# EAGLE design NT1066_Discovery (EAGLE 9.6.2)
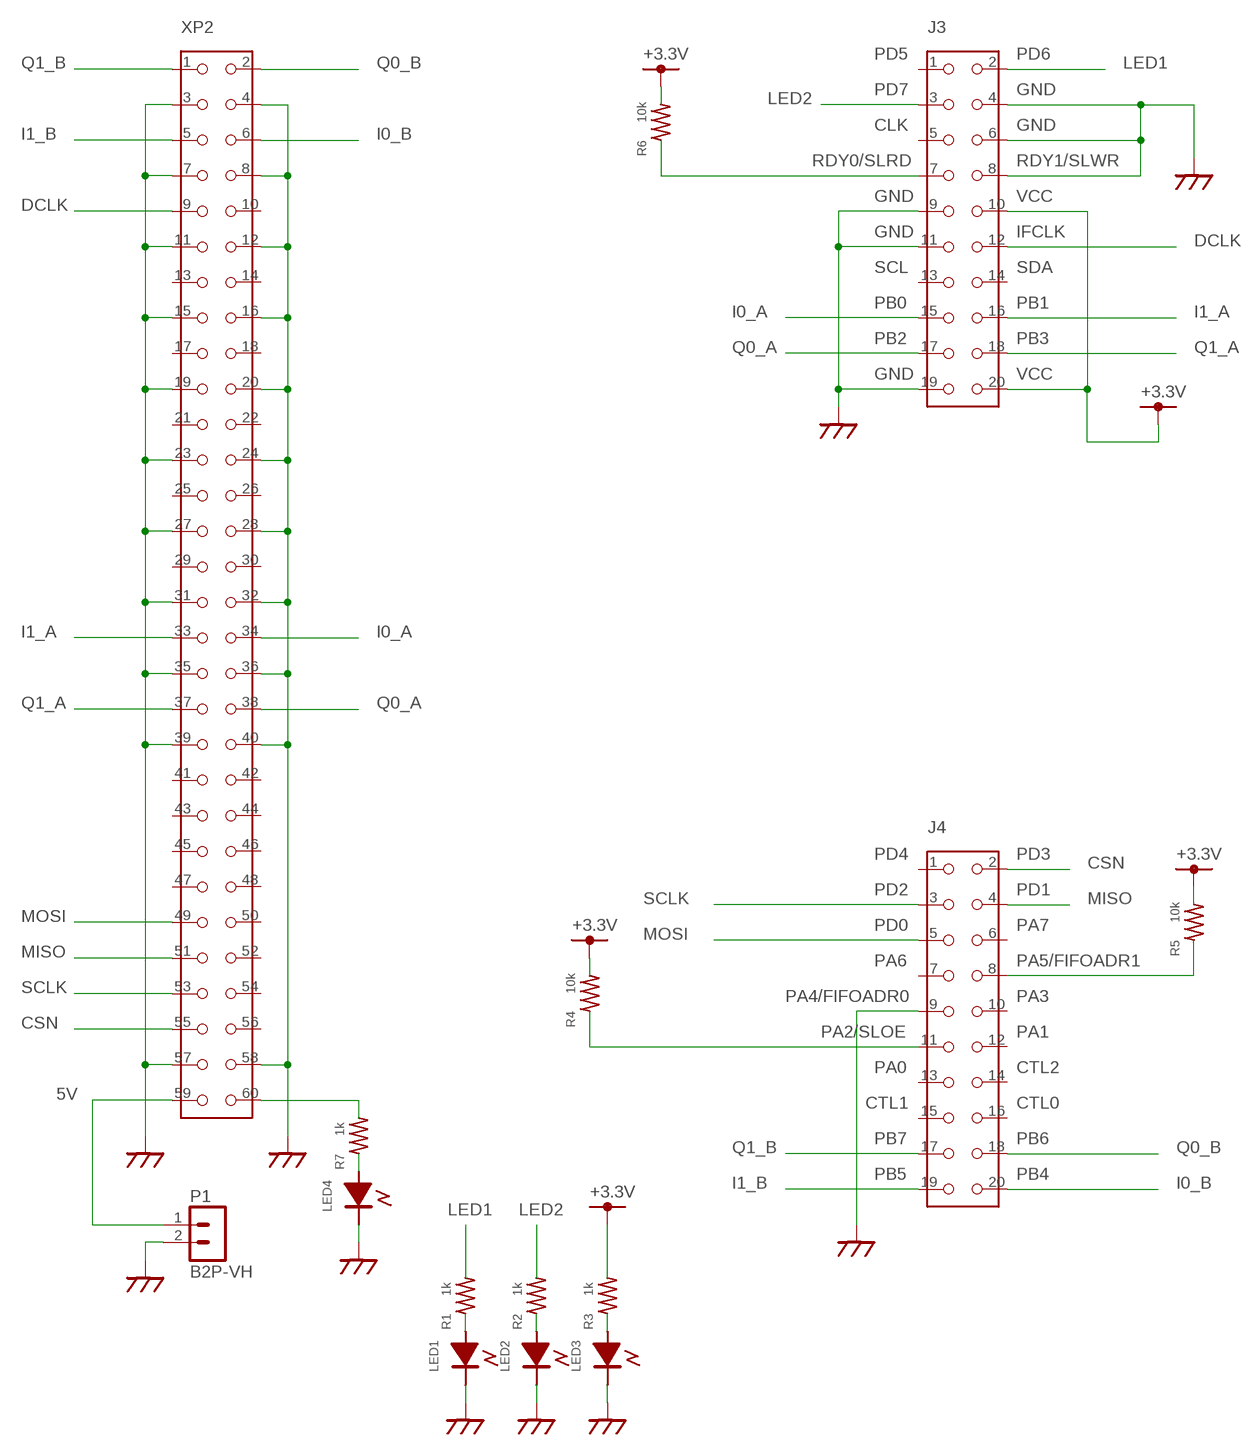
[diagram p0: schematic, sheet 1]

## Parts
J3  PINH-2.54MM-20P  [PINH-2.54MM-20P]
J4  PINH-2.54MM-20P  [PINH-2.54MM-20P]
LED1  LED1608  [LED_1608]
LED2  LED1608  [LED_1608]
LED3  LED1608  [LED_1608]
LED4  LED1608  [LED_1608]
P1  B2P-VH  [B2P-VH]
R1  1k  R1608  [C1608]
R2  1k  R1608  [C1608]
R3  1k  R1608  [C1608]
R4  10k  R1608  [C1608]
R5  10k  R1608  [C1608]
R6  10k  R1608  [C1608]
R7  1k  R1608  [C1608]
XP2  PINH-2.54MM-60P  [PINH-2.54MM-60P]

## Nets
5V: P1.1 XP2.59
+3.3V: J3.10 J3.20 R3.2 R4.2 R5.2 R6.2
CSN: J4.2 XP2.55
DCLK: J3.12 XP2.9
FIFOADR1: J4.8 R5.1
GND: J3.4 J3.6 J3.8 J3.9 J3.11 J3.19 J4.9 LED1.2 LED2.2 LED3.2 LED4.2 P1.2 XP2.3 XP2.4 XP2.7 XP2.8 XP2.11 XP2.12 XP2.15 XP2.16 XP2.19 XP2.20 XP2.23 XP2.24 XP2.27 XP2.28 XP2.31 XP2.32 XP2.35 XP2.36 XP2.39 XP2.40 XP2.57 XP2.58
I0_A: J3.15 XP2.34
I0_B: J4.20 XP2.6
I1_A: J3.16 XP2.33
I1_B: J4.19 XP2.5
LED1: J3.2 R1.2
LED2: J3.3 R2.2
MISO: J4.4 XP2.51
MOSI: J4.5 XP2.49
N$1: R7.2 XP2.60
N$2: LED4.1(+) R7.1
N$5: LED3.1(+) R3.1
N$6: LED2.1(+) R2.1
N$7: LED1.1(+) R1.1
Q0_A: J3.17 XP2.38
Q0_B: J4.18 XP2.2
Q1_A: J3.18 XP2.37
Q1_B: J4.17 XP2.1
SCLK: J4.3 XP2.53
SLOE: J4.11 R4.1
SLRD: J3.7 R6.1
Unconnected: J3.1 J3.5 J3.13 J3.14 J4.1 J4.6 J4.7 J4.10 J4.12 J4.13 J4.14 J4.15 J4.16 XP2.10 XP2.13 XP2.14 XP2.17 XP2.18 XP2.21 XP2.22 XP2.25 XP2.26 XP2.29 XP2.30 XP2.41 XP2.42 XP2.43 XP2.44 XP2.45 XP2.46 XP2.47 XP2.48 XP2.50 XP2.52 XP2.54 XP2.56

## Notes on the sheet
- PD5 | PD6
- PD7 | GND
- CLK | GND
- RDY0/SLRD | RDY1/SLWR
- GND | VCC
- GND | IFCLK
- SCL | SDA
- PB0 | PB1
- PB2 | PB3
- GND | VCC
- PD4 | PD3
- PD2 | PD1
- PD0 | PA7
- PA6 | PA5/FIFOADR1
- PA4/FIFOADR0 | PA3
- PA2/SLOE | PA1
- PA0 | CTL2
- CTL1 | CTL0
- PB7 | PB6
- PB5 | PB4

## Library data of the parts
J3 J4 = ttaka_conn:PINH-2.54MM-20P
LED1-LED4 = ttaka_desc:LED1608
P1 = ttaka_conn:B2P-VH
R1-R7 = ttaka_desc:R1608
XP2 = ttaka_conn:PINH-2.54MM-60P

## Board
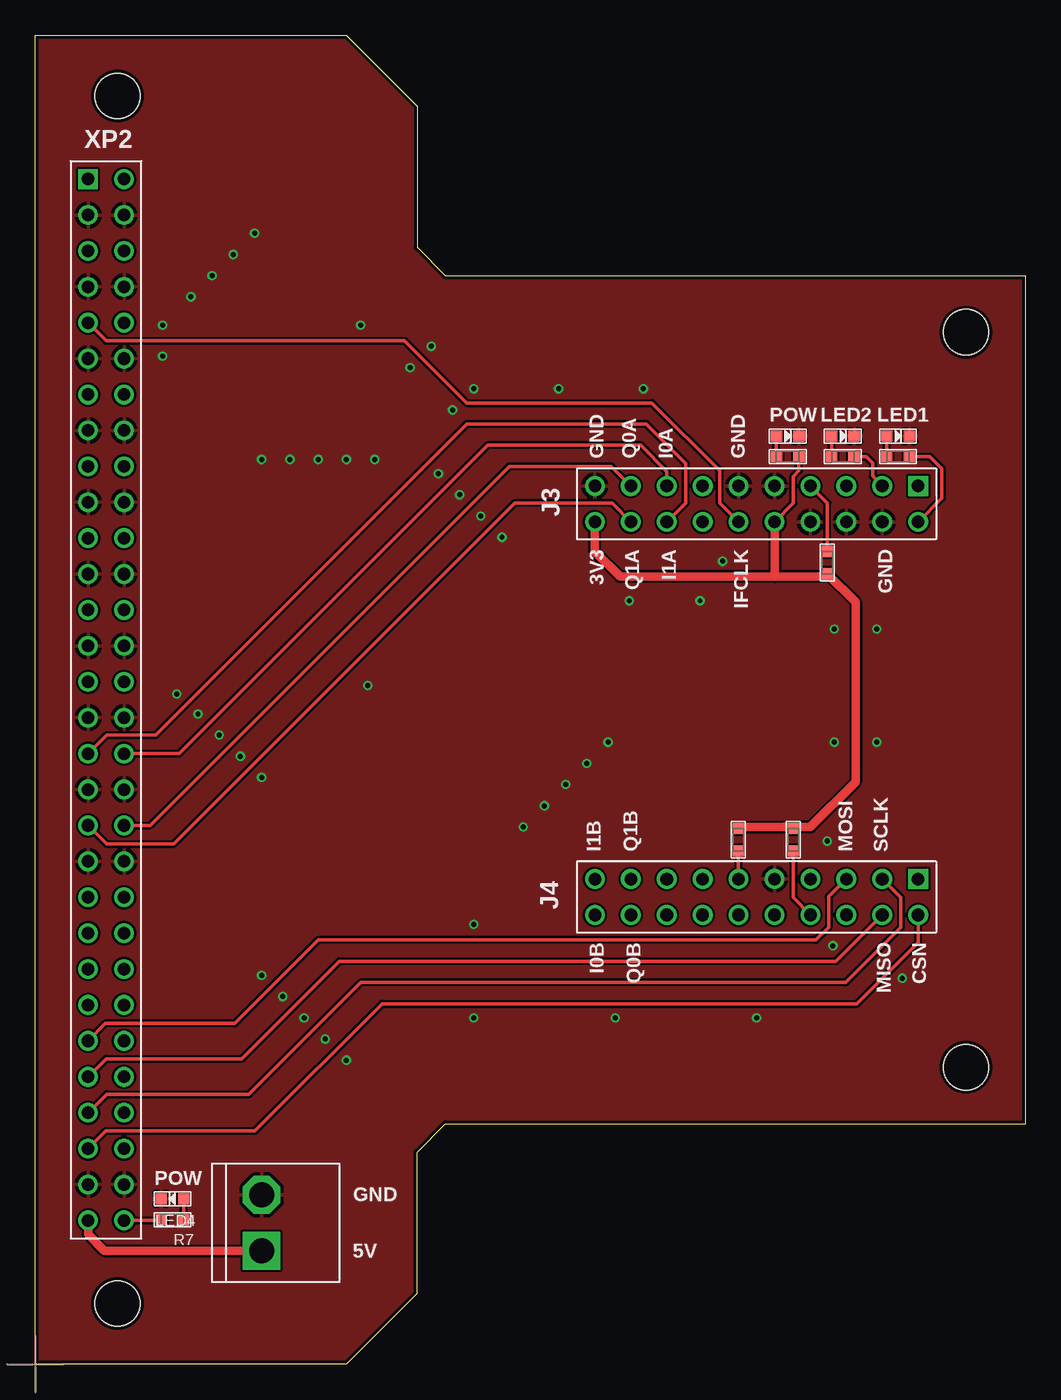
[diagram p1: board, top side]
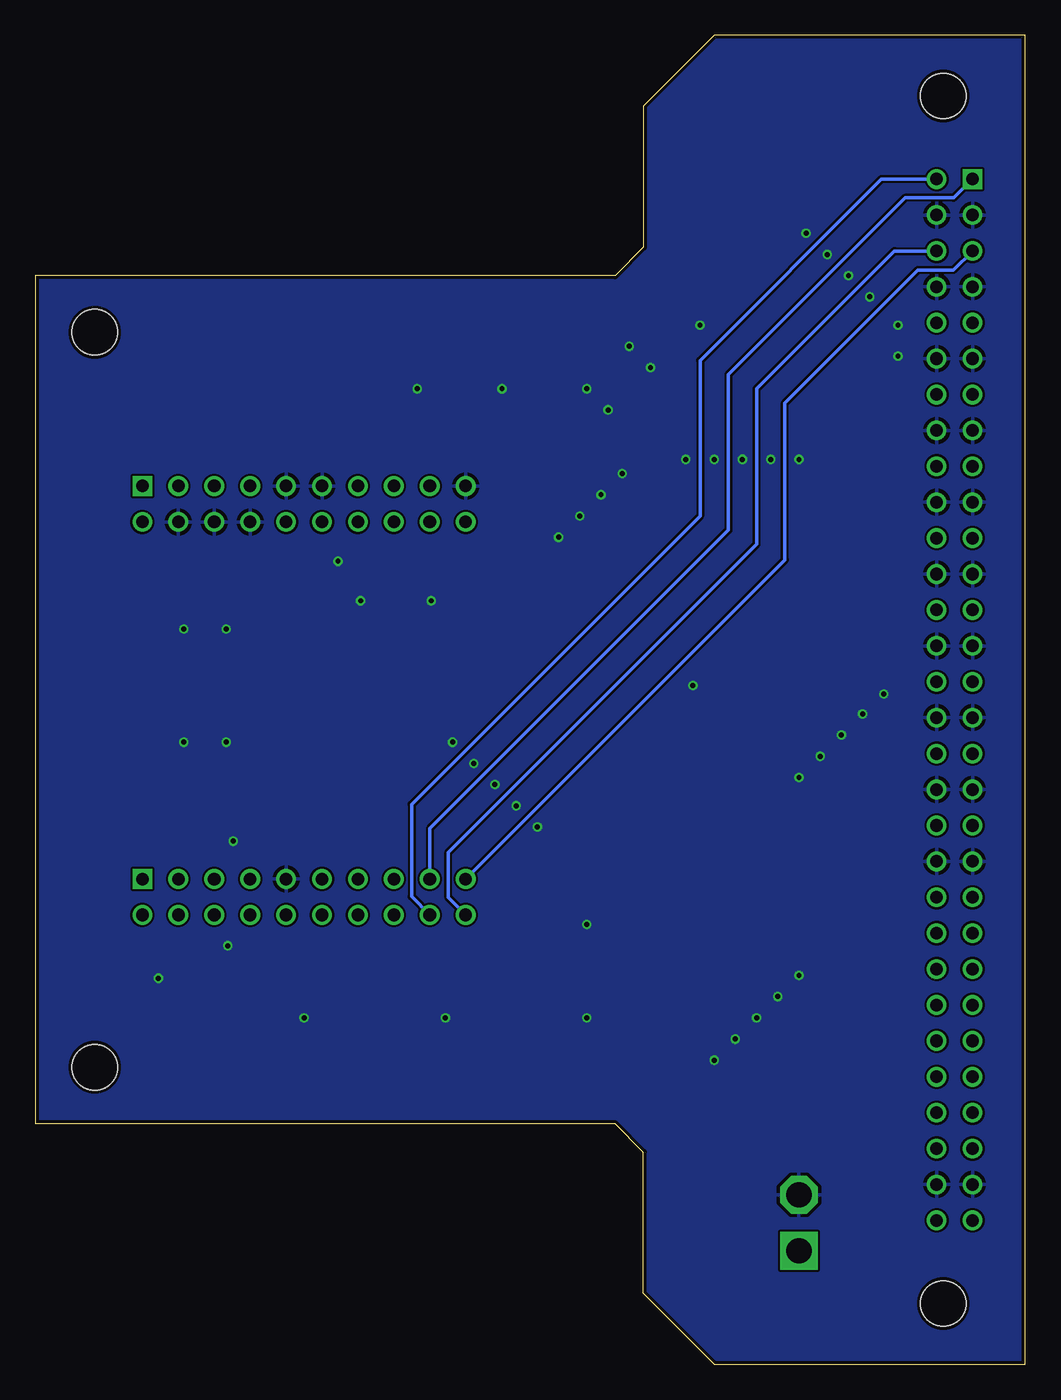
[diagram p2: board, bottom side, seen from below]

Size 70 x 94 mm. Coordinates in mm from the lower left corner, seen from the top.
Outline: 0,0 0,94 22,94 27,89 27,79 29,77 70,77 70,17 29,17 27,15 27,5 22,0 0,0
Copper layers (1*16): Top 0.035mm / dielectric 1.5mm / Bottom 0.035mm
Design rules "SeeedStudio_2layer_DRU_no_angle_20140221": minimum track width 6mil, minimum drill 12mil, track to track 6mil, track to pad 6mil, pad to pad 6mil, via to via 6mil, smd to smd 0mil, copper to edge 10mil, drill to drill 10mil, minimum pad ring 10mil, minimum via ring 6mil, stop-mask expansion 2mil, vias tented up to drill 100mil, thermal gap 10mil
Holes 3.2 mm at 5.8,89.7 5.8,4.3 65.8,21 65.8,73

### Footprints (pad centres in the part's own frame; a part is rotated, then mirrored left to right if it is on the bottom)
PINH-2.54MM-20P = drill 0.889 square: 1 -11.43,-1.27 | drill 0.889: 2 -11.43,1.27; 3 -8.89,-1.27; 4 -8.89,1.27; 5 -6.35,-1.27; 6 -6.35,1.27; 7 -3.81,-1.27; 8 -3.81,1.27; 9 -1.27,-1.27; 10 -1.27,1.27; 11 1.27,-1.27; 12 1.27,1.27; 13 3.81,-1.27; 14 3.81,1.27; 15 6.35,-1.27; 16 6.35,1.27; 17 8.89,-1.27; 18 8.89,1.27; 19 11.43,-1.27; 20 11.43,1.27
LED_1608 = smd 0.8 x 0.8: 1 -0.8,0; 2 0.8,0
B2P-VH = drill 1.778 square: 1 -1.98,0 | drill 1.778 octagon: 2 1.98,0
C1608 = smd 0.8 x 0.8: 1 -0.8,0; 2 0.8,0
PINH-2.54MM-60P = drill 0.889 square: 1 -36.83,-1.27 | drill 0.889: 2 -36.83,1.27; 3 -34.29,-1.27; 4 -34.29,1.27; 5 -31.75,-1.27; 6 -31.75,1.27; 7 -29.21,-1.27; 8 -29.21,1.27; 9 -26.67,-1.27; 10 -26.67,1.27; 11 -24.13,-1.27; 12 -24.13,1.27; 13 -21.59,-1.27; 14 -21.59,1.27; 15 -19.05,-1.27; 16 -19.05,1.27; 17 -16.51,-1.27; 18 -16.51,1.27; 19 -13.97,-1.27; 20 -13.97,1.27; 21 -11.43,-1.27; 22 -11.43,1.27; 23 -8.89,-1.27; 24 -8.89,1.27; 25 -6.35,-1.27; 26 -6.35,1.27; 27 -3.81,-1.27; 28 -3.81,1.27; 29 -1.27,-1.27; 30 -1.27,1.27; 31 1.27,-1.27; 32 1.27,1.27; 33 3.81,-1.27; 34 3.81,1.27; 35 6.35,-1.27; 36 6.35,1.27; 37 8.89,-1.27; 38 8.89,1.27; 39 11.43,-1.27; 40 11.43,1.27; 41 13.97,-1.27; 42 13.97,1.27; 43 16.51,-1.27; 44 16.51,1.27; 45 19.05,-1.27; 46 19.05,1.27; 47 21.59,-1.27; 48 21.59,1.27; 49 24.13,-1.27; 50 24.13,1.27; 51 26.67,-1.27; 52 26.67,1.27; 53 29.21,-1.27; 54 29.21,1.27; 55 31.75,-1.27; 56 31.75,1.27; 57 34.29,-1.27; 58 34.29,1.27; 59 36.83,-1.27; 60 36.83,1.27

### Placement (x,y rotation side)
J3  51,60.85 180 top
J4  51,33.05 180 top
LED1  61,65.65 0 top
LED2  57.1,65.65 0 top
LED3  53.2,65.65 0 top
LED4  9.7,11.7 180 top
P1  16,10 90 top
R1  61,64.2 0 top
R2  57.1,64.2 0 top
R3  53.2,64.2 0 top
R4  49.7,37.1 90 top
R5  53.6,37.1 90 top
R6  56,56.7 270 top
R7  9.7,10.2 180 top
XP2  5,47 270 top

### Tracks (layer width: path | path; a pad name or v marks a point on that pad's centre or on a via)
5V
  Top 0.61: XP2.59 3.73,9.17 4.88,8.02 P1.1
+3.3V
  Top 0.254: J3.10 53.6,60.91 53.6,62.8 54,63.2 R3.2 | R4.2 49.8,38 | R5.2 53.5,38
  Top 0.406: 52.27,55.73 52.3,55.7
  Top 0.61: J3.10 52.27,55.73 | 49.8,38 53.5,38 54.8,38 58,41.2 58,53.9 R6.2 56.2,55.7 52.3,55.7 41.35,55.7 39.57,57.48 J3.20 39.57,59.63
CSN
  Top 0.254: J4.2 62.43,29.83 58.1,25.5 24.52,25.5 15.52,16.5 4.98,16.5 XP2.55
DCLK
  Top 0.254: XP2.9 5,72.4 26.1,72.4 30.5,68 43.6,68 48.4,63.2 48.4,60.91 J3.12
FIFOADR1
  Top 0.254: R5.1 53.6,33 J4.8
GND  (via drill 0.35)
  other vias: 18,64 16,64 11.5,46 13,44.5 14.5,43 16,41.5 10,47.4 33,58.5 40.5,44 22,64 24,64 20,64 36,39.5 34.5,38 19,24.5 20.5,23 22,21.5 17.5,26 16,27.5 61.3,27.3 56.4,29.6 51,24.5 41,24.5 31,24.5 31,31.1 56,37 39,42.5 37.5,41 56.5,44 59.5,44 56.5,52 59.5,52 23.5,48 48.6,56.8 47,54 42,54 43,69 37,69 31,69 28.5,63 30,61.5 31.5,60 29.5,67.5 28,72 26.5,70.5 9,73.5 9,71.3 11,75.5 12.5,77 14,78.5 15.5,80 23,73.5
  pour Top: -1.5,95.25 -1.5,-1.35 70.5,-1.35 70.5,95.25
  pour Bottom: -2,95.75 -2,-1.85 71,-1.85 71,95.75
I0_A
  Top 0.254: J3.15 44.65,63.15 42.8,65 32,65 10.19,43.19 XP2.34
I0_B
  Bottom 0.254: J4.20 40.8,33.01 40.8,36.2 19,58 19,69 9.25,78.75 XP2.6
I1_A
  Top 0.254: J3.16 46,60.93 46,63.7 43.2,66.5 30.5,66.5 8.5,44.5 5.04,44.5 XP2.33
I1_B
  Bottom 0.254: XP2.5 5.08,77.4 7.6,77.4 17,68 17,56.89 J4.19
LED1
  Top 0.254: J3.2 64.1,61.25 64.1,63.35 63.25,64.2 R1.2
LED2
  Top 0.254: J3.3 59.2,62.81 59.2,63.75 58.75,64.2 R2.2
MISO
  Top 0.254: J4.4 56.61,28.5 21.5,28.5 14.6,21.6 5,21.6 XP2.51
MOSI
  Top 0.254: XP2.49 4.96,24.1 14.1,24.1 20,30 55.2,30 56.1,30.9 56.1,33.07 J4.5
N$1
  Top 0.254: XP2.60 8.87,10.17 R7.2
N$2
  Top 0.254: R7.1 LED4.1
N$5
  Top 0.254: R3.1 LED3.1
N$6
  Top 0.254: R2.1 LED2.1
N$7
  Top 0.254: R1.1 LED1.1
Q0_A
  Top 0.254: J3.17 40.73,63.5 33.5,63.5 8.11,38.11 XP2.38
Q0_B
  Bottom 0.254: J4.18 43.4,33.07 43.4,39.6 23,60 23,71 10.17,83.83 XP2.2
Q1_A
  Top 0.254: J3.18 40.79,60.9 33.9,60.9 9.8,36.8 5.04,36.8 XP2.37
Q1_B
  Bottom 0.254: XP2.1 5.06,82.5 8.5,82.5 21,70 21,59 42.11,37.89 J4.17
SCLK
  Top 0.254: J4.3 61.2,33.01 61.2,30.9 57.3,27 23,27 15.1,19.1 5.04,19.1 XP2.53
SLOE
  Top 0.152: J4.11 49.73,34.38 49.7,34.41
  Top 0.254: R4.1 49.7,34.41
SLRD
  Top 0.254: J3.7 56,60.93 R6.1 56,57.35

### Text on the board
tPlace: XP2 | POW | LED2 | LED1 | GND | Q0A | I0A | GND | J3 | 3V3 | Q1A | I1A | IFCLK | GND | I1B | Q1B | MOSI | SCLK | J4 | I0B | Q0B | MISO | CSN | POW | GND | 5V